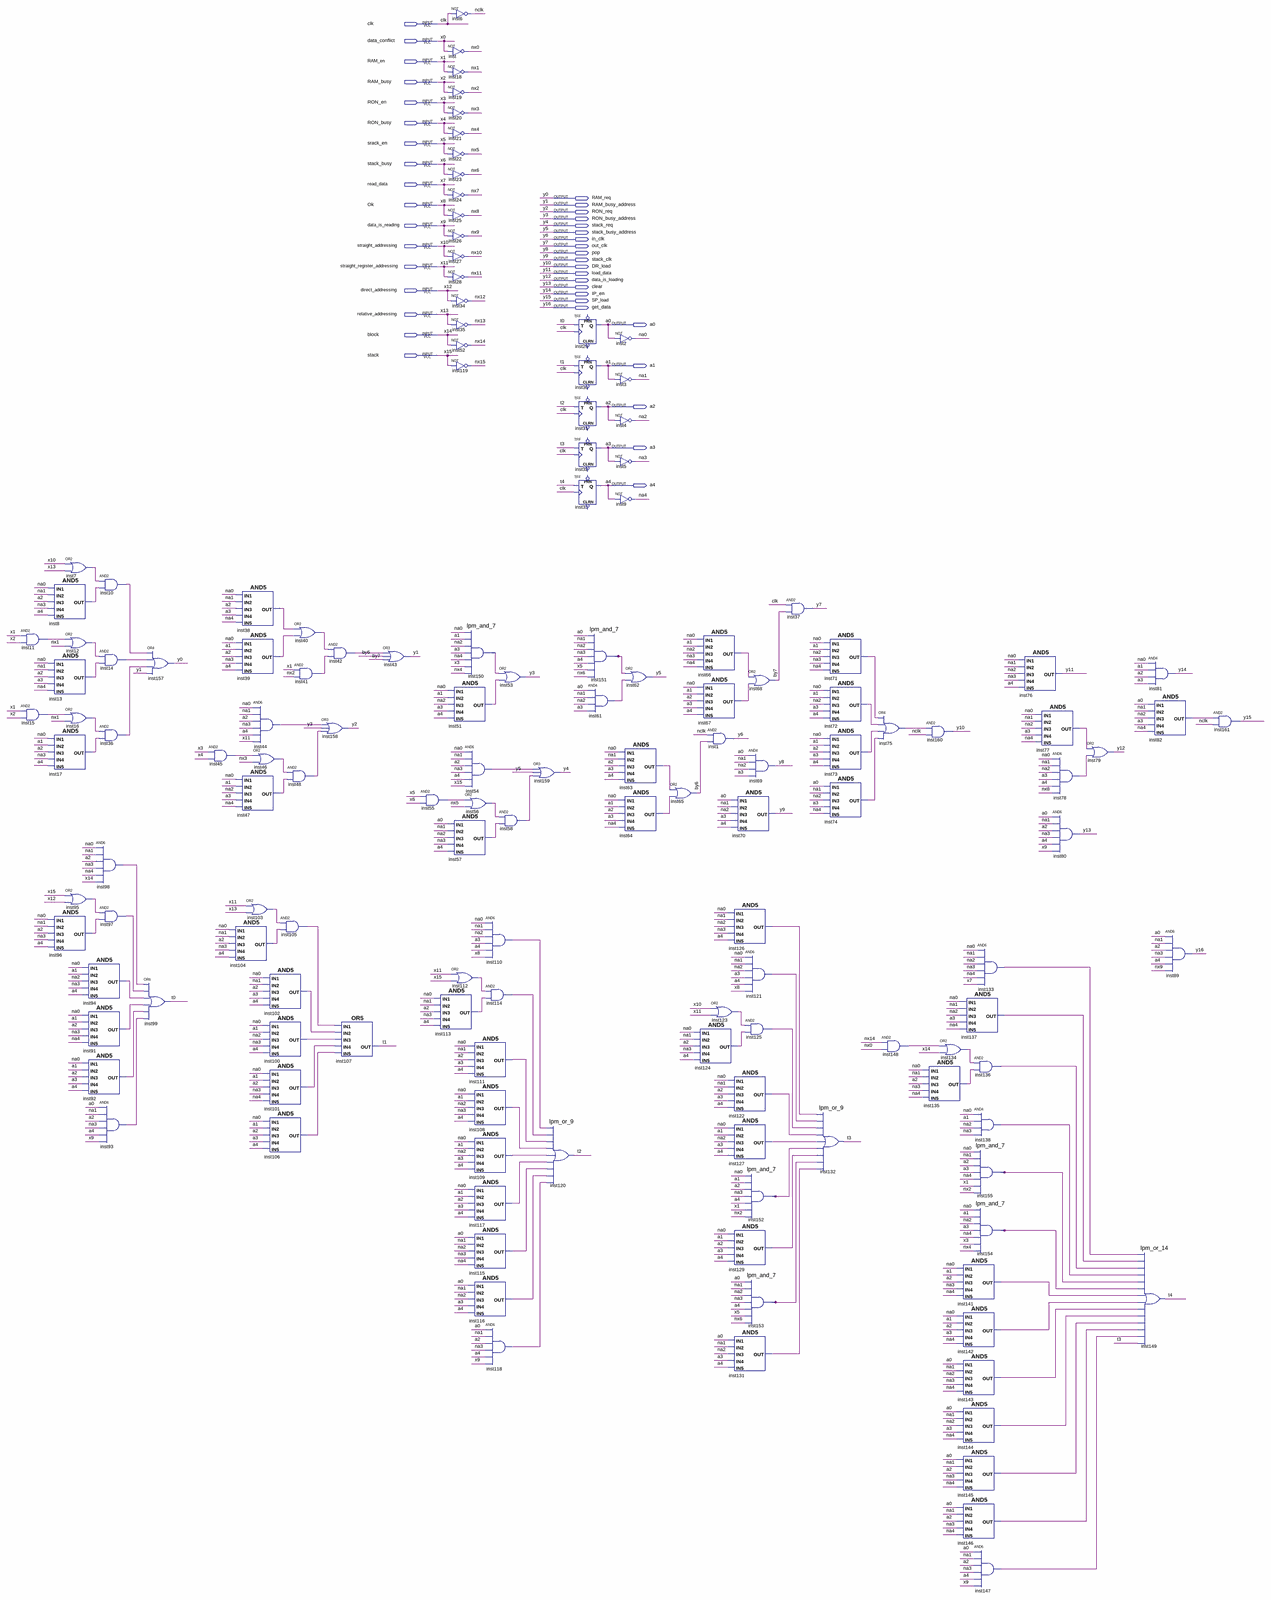
[diagram p0: schematic sheet, whole]
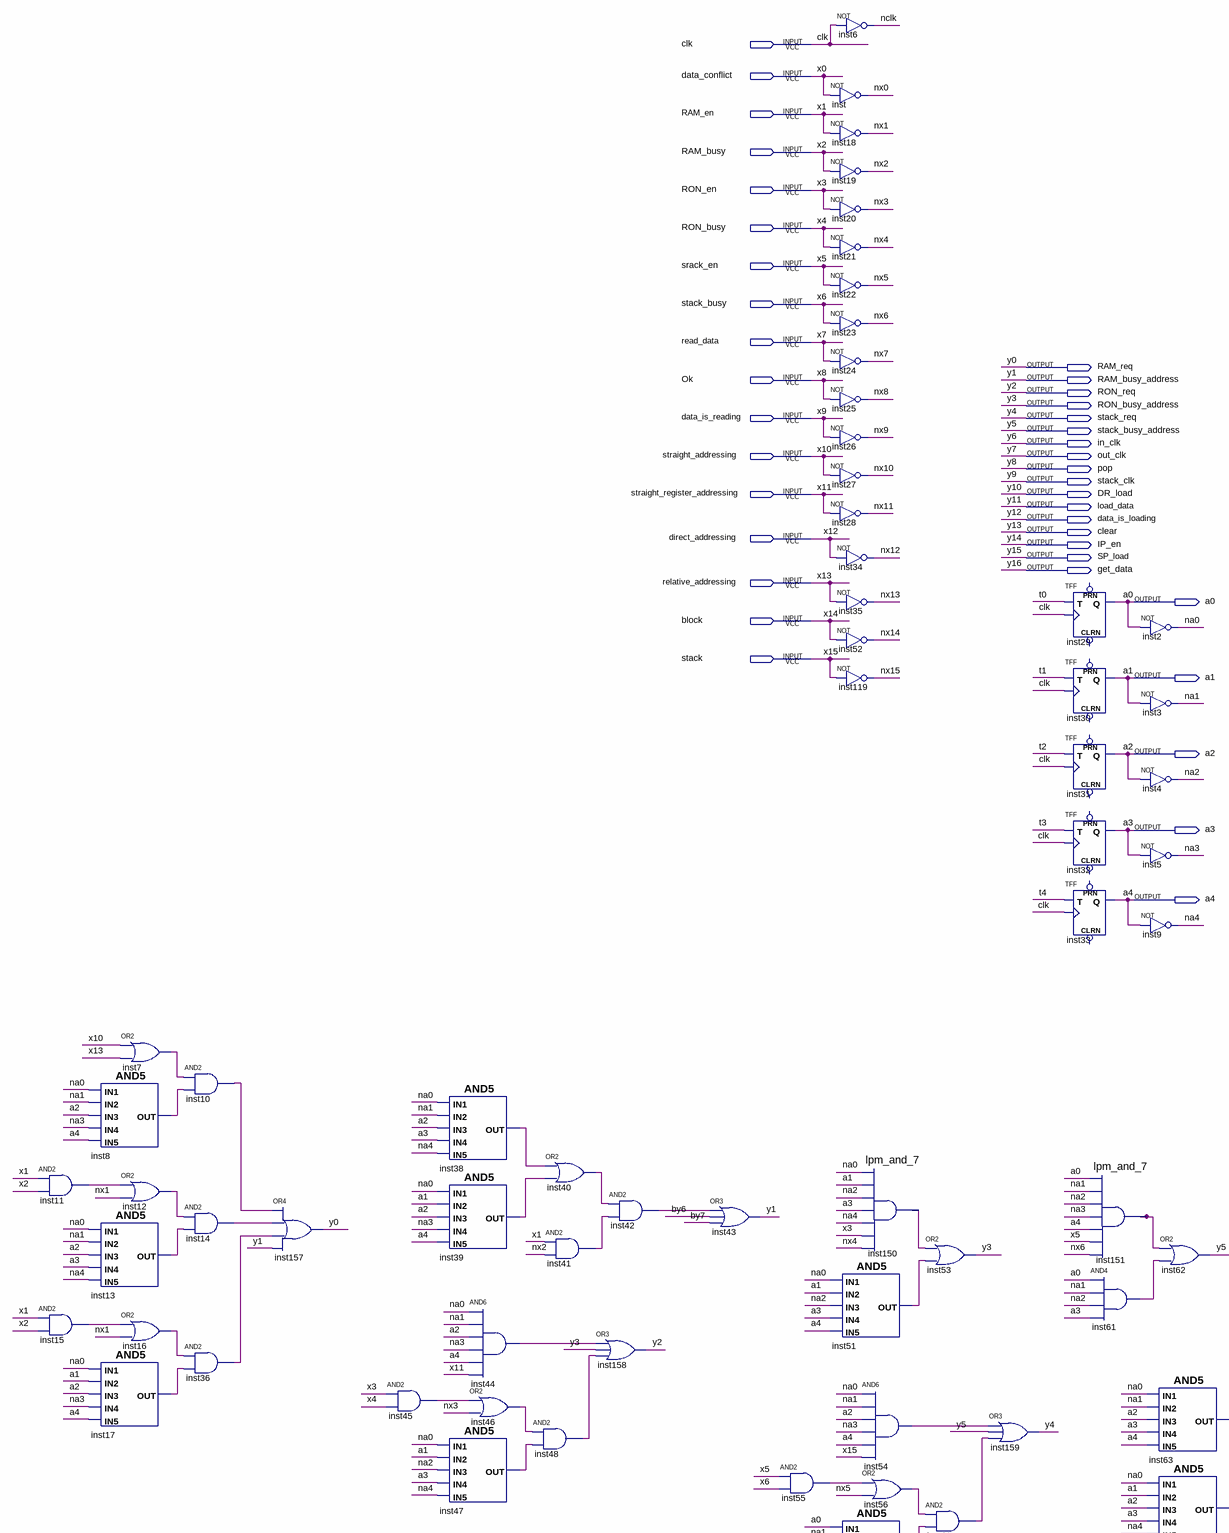
[diagram p1: schematic sheet, upper left part]
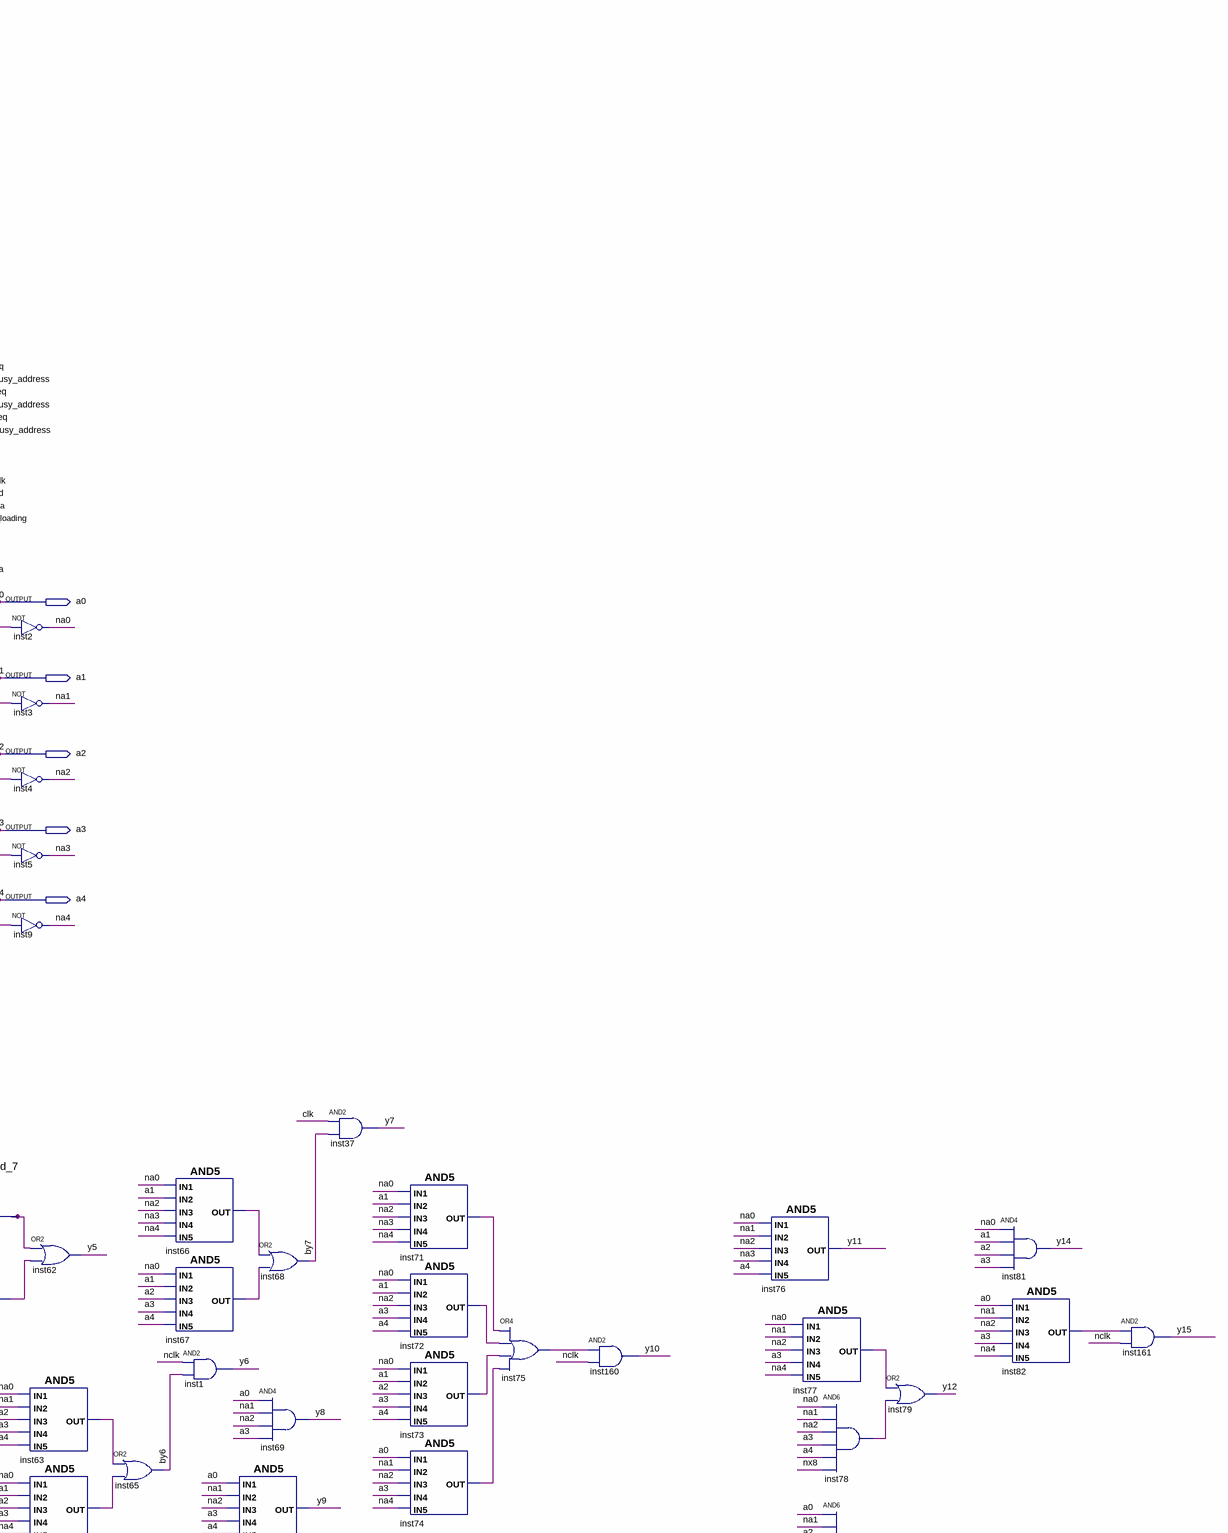
[diagram p2: schematic sheet, upper right part]
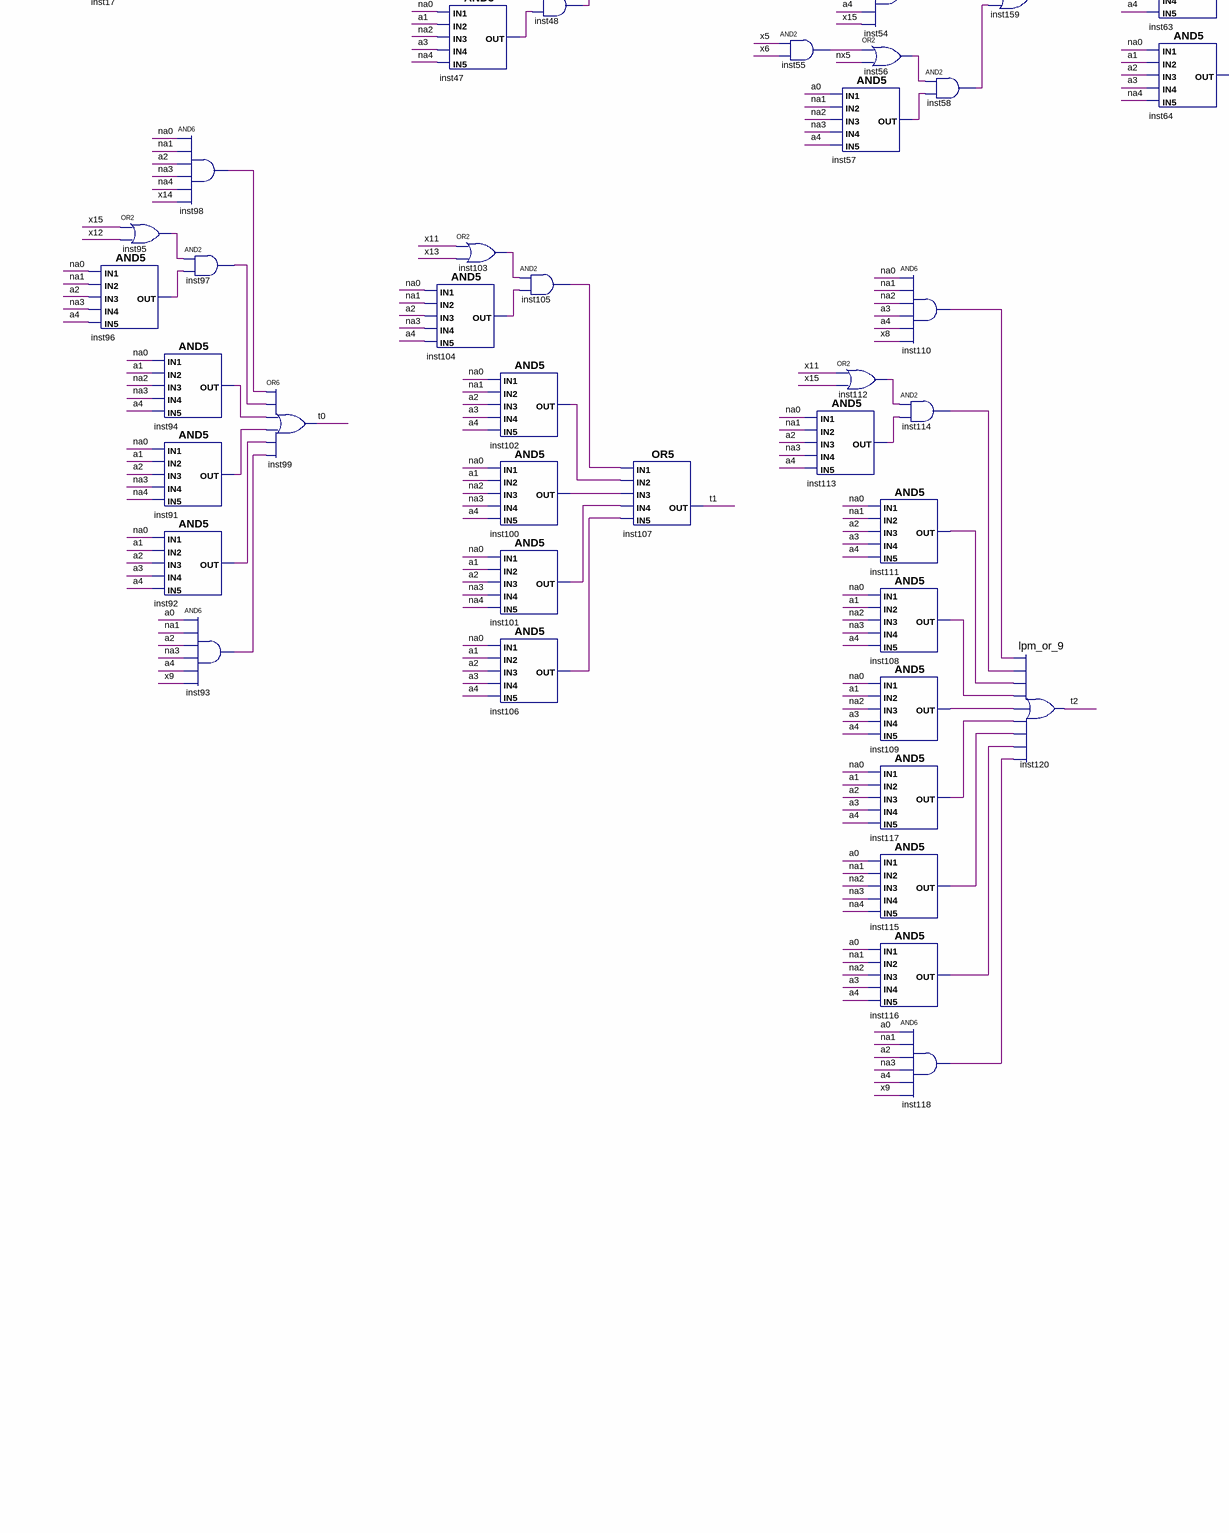
[diagram p3: schematic sheet, lower left part]
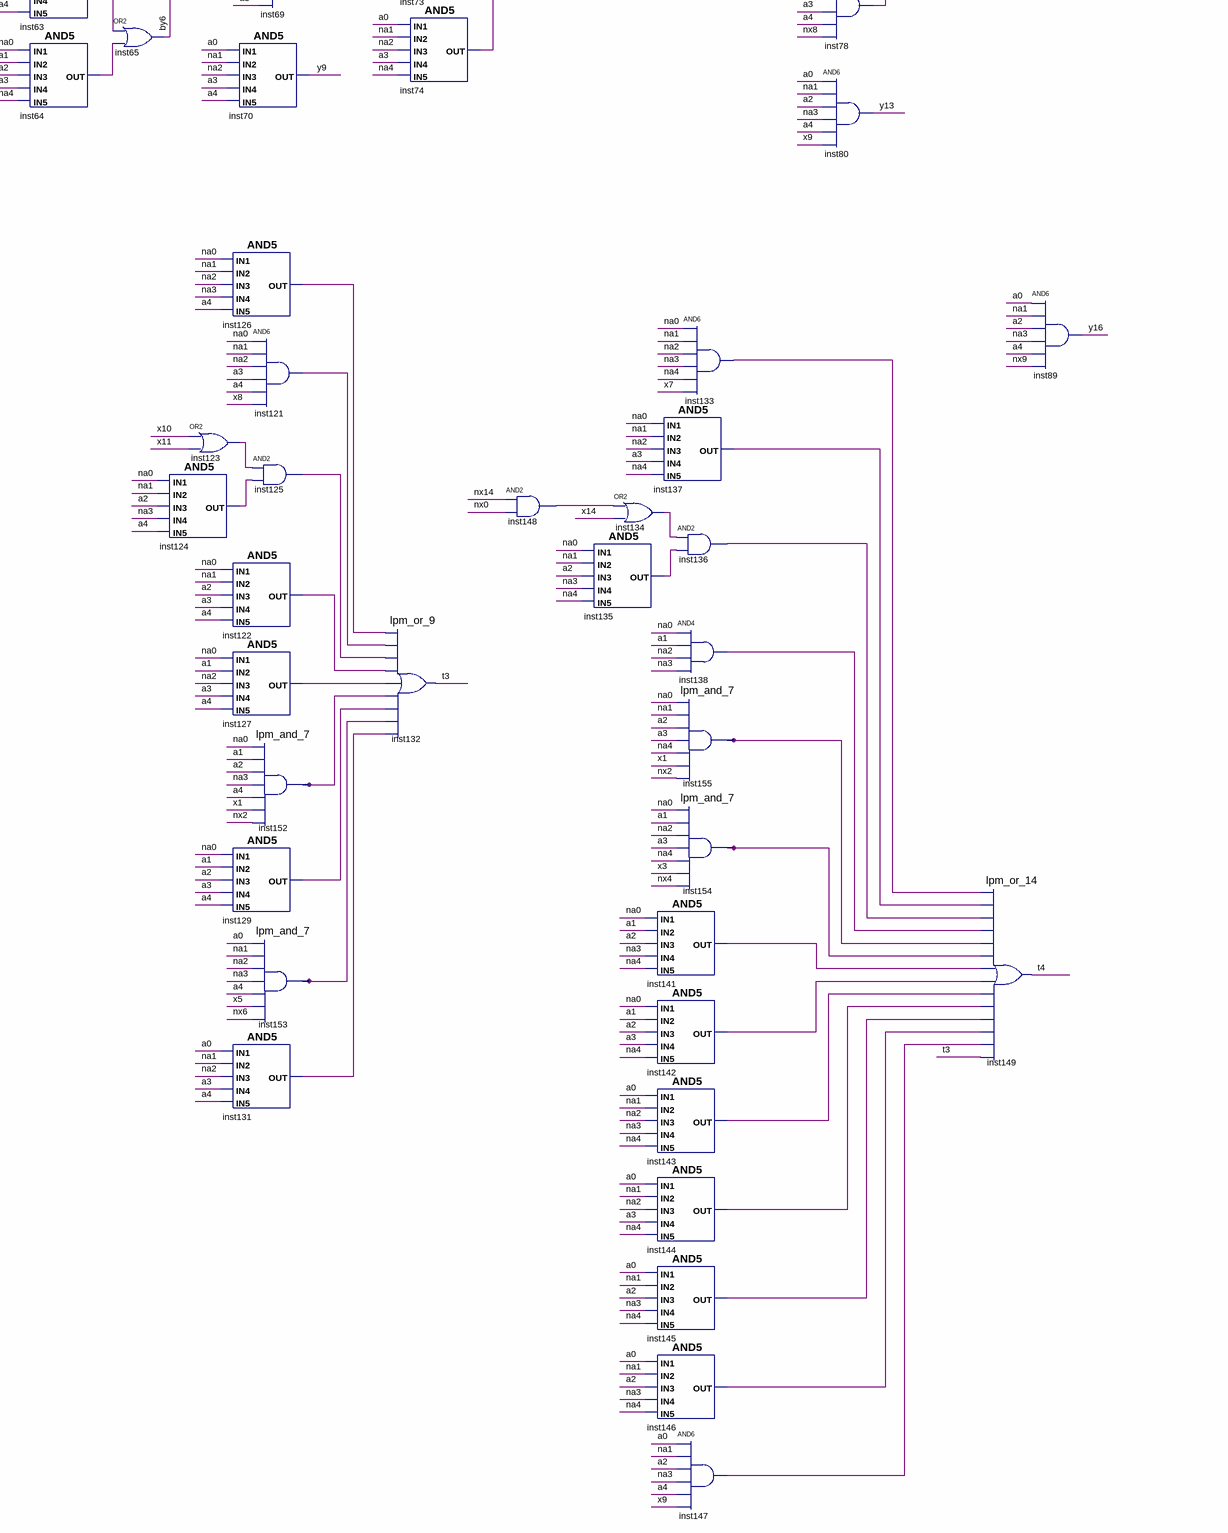
[diagram p4: schematic sheet, lower right part]
// Quartus schematic read_data.bdf as structural Verilog: 146 symbols, 39 pins
module read_data (
  input  clk,
  input  data_conflict,
  input  RAM_en,
  input  RAM_busy,
  input  RON_en,
  input  RON_busy,
  input  srack_en,
  input  stack_busy,
  input  read_data,
  input  Ok,
  input  data_is_reading,
  input  straight_addressing,
  input  straight_register_addressing,
  input  direct_addressing,
  input  relative_addressing,
  input  block,
  input  stack,
  output RAM_req,
  output RAM_busy_address,
  output RON_req,
  output RON_busy_address,
  output stack_req,
  output stack_busy_address,
  output in_clk,
  output out_clk,
  output pop,
  output stack_clk,
  output DR_load,
  output load_data,
  output data_is_loading,
  output clear,
  output IP_en,
  output SP_load,
  output get_data,
  output a0,
  output a1,
  output a2,
  output a3,
  output a4
);

  wire by6, by7, inst7_out, inst8_out, inst10_out, inst11_out, inst12_out, inst13_out, inst14_out,
       inst15_out, inst16_out, inst17_out, inst36_out, inst38_out, inst39_out, inst40_out, inst41_out,
       inst42_out, inst44_out, inst45_out, inst46_out, inst47_out, inst48_out, inst51_out, inst54_out,
       inst55_out, inst56_out, inst57_out, inst58_out, inst61_out, inst63_out, inst64_out, inst66_out,
       inst67_out, inst71_out, inst72_out, inst73_out, inst74_out, inst75_out, inst77_out, inst78_out,
       inst82_out, inst91_out, inst92_out, inst93_out, inst94_out, inst95_out, inst96_out, inst97_out,
       inst98_out, inst100_out, inst101_out, inst102_out, inst103_out, inst104_out, inst105_out, inst106_out,
       inst108_out, inst109_out, inst110_out, inst111_out, inst112_out, inst113_out, inst114_out,
       inst115_out, inst116_out, inst117_out, inst118_out, inst121_out, inst122_out, inst123_out,
       inst124_out, inst125_out, inst126_out, inst127_out, inst129_out, inst131_out, inst133_out,
       inst134_out, inst135_out, inst136_out, inst137_out, inst138_out, inst141_out, inst142_out,
       inst143_out, inst144_out, inst145_out, inst146_out, inst147_out, inst148_out, inst150_result,
       inst151_result, inst152_result, inst153_result, inst154_result, inst155_result, na0, na1, na2, na3,
       na4, nclk, nx0, nx1, nx2, nx3, nx4, nx5, nx6, nx7, nx8, nx9, nx10, nx11, nx12, nx13, nx14, nx15, t0,
       t1, t2, t3, t4;

  and inst11 (inst11_out, RAM_en, RAM_busy);
  and inst15 (inst15_out, RAM_en, RAM_busy);
  or inst7 (inst7_out, straight_addressing, relative_addressing);
  and inst8 (inst8_out, na0, na1, a2, na3, a4);
  or inst12 (inst12_out, inst11_out, nx1);
  and inst13 (inst13_out, na0, na1, a2, a3, na4);
  or inst16 (inst16_out, inst15_out, nx1);
  and inst17 (inst17_out, na0, a1, a2, na3, a4);
  or inst95 (inst95_out, stack, direct_addressing);
  and inst96 (inst96_out, na0, na1, a2, na3, a4);
  and inst10 (inst10_out, inst7_out, inst8_out);
  and inst14 (inst14_out, inst12_out, inst13_out);
  and inst36 (inst36_out, inst16_out, inst17_out);
  and inst98 (inst98_out, na0, na1, a2, na3, na4, block);
  and inst97 (inst97_out, inst95_out, inst96_out);
  and inst94 (inst94_out, na0, a1, na2, na3, a4);
  and inst91 (inst91_out, na0, a1, a2, na3, na4);
  and inst92 (inst92_out, na0, a1, a2, a3, a4);
  and inst93 (inst93_out, a0, na1, a2, na3, a4, data_is_reading);
  or inst157 (RAM_req, inst10_out, inst14_out, inst36_out, RAM_busy_address);
  or inst99 (t0, inst98_out, inst97_out, inst94_out, inst91_out, inst92_out, inst93_out);
  and inst45 (inst45_out, RON_en, RON_busy);
  and inst38 (inst38_out, na0, na1, a2, a3, na4);
  and inst39 (inst39_out, na0, a1, a2, na3, a4);
  and inst47 (inst47_out, na0, a1, na2, a3, na4);
  and inst104 (inst104_out, na0, na1, a2, na3, a4);
  and inst44 (inst44_out, na0, na1, a2, na3, a4, straight_register_addressing);
  or inst46 (inst46_out, inst45_out, nx3);
  or inst103 (inst103_out, straight_register_addressing, relative_addressing);
  and inst102 (inst102_out, na0, na1, a2, a3, a4);
  and inst100 (inst100_out, na0, a1, na2, na3, a4);
  and inst101 (inst101_out, na0, a1, a2, na3, na4);
  and inst106 (inst106_out, na0, a1, a2, a3, a4);
  and inst48 (inst48_out, inst46_out, inst47_out);
  and inst105 (inst105_out, inst103_out, inst104_out);
  or inst40 (inst40_out, inst38_out, inst39_out);
  and inst41 (inst41_out, RAM_en, nx2);
  and inst42 (inst42_out, inst40_out, inst41_out);
  or inst158 (RON_req, inst44_out, RON_busy_address, inst48_out);
  or inst107 (t1, inst105_out, inst102_out, inst100_out, inst101_out, inst106_out);
  or inst43 (RAM_busy_address, inst42_out, by6, by7);
  and inst55 (inst55_out, srack_en, stack_busy);
  not inst6 (nclk, clk);
  not inst (nx0, data_conflict);
  not inst18 (nx1, RAM_en);
  not inst19 (nx2, RAM_busy);
  not inst20 (nx3, RON_en);
  not inst21 (nx4, RON_busy);
  not inst22 (nx5, srack_en);
  not inst23 (nx6, stack_busy);
  not inst24 (nx7, read_data);
  not inst25 (nx8, Ok);
  not inst26 (nx9, data_is_reading);
  not inst27 (nx10, straight_addressing);
  not inst28 (nx11, straight_register_addressing);
  not inst34 (nx12, direct_addressing);
  not inst35 (nx13, relative_addressing);
  not inst52 (nx14, block);
  not inst119 (nx15, stack);
  and inst51 (inst51_out, na0, a1, na2, a3, a4);
  and inst57 (inst57_out, a0, na1, na2, na3, a4);
  or inst112 (inst112_out, straight_register_addressing, stack);
  and inst113 (inst113_out, na0, na1, a2, na3, a4);
  lpm_and_7 inst150 (
    .data0(na0), .data1(a1), .data2(na2), .data3(a3), .data4(na4), .data5(RON_en), .data6(nx4),
    .result(inst150_result));
  and inst54 (inst54_out, na0, na1, a2, na3, a4, stack);
  or inst56 (inst56_out, inst55_out, nx5);
  and inst111 (inst111_out, na0, na1, a2, a3, a4);
  and inst108 (inst108_out, na0, a1, na2, na3, a4);
  and inst109 (inst109_out, na0, a1, na2, a3, a4);
  and inst117 (inst117_out, na0, a1, a2, a3, a4);
  and inst115 (inst115_out, a0, na1, na2, na3, na4);
  and inst116 (inst116_out, a0, na1, na2, a3, a4);
  or inst53 (RON_busy_address, inst150_result, inst51_out);
  and inst58 (inst58_out, inst56_out, inst57_out);
  and inst110 (inst110_out, na0, na1, na2, a3, a4, Ok);
  and inst114 (inst114_out, inst112_out, inst113_out);
  and inst118 (inst118_out, a0, na1, a2, na3, a4, data_is_reading);
  or inst159 (stack_req, inst54_out, stack_busy_address, inst58_out);
  lpm_or_9 inst120 (
    .data0(inst110_out), .data1(inst114_out), .data2(inst111_out), .data3(inst108_out), .data4(inst109_out),
    .data5(inst117_out), .data6(inst115_out), .data7(inst116_out), .data8(inst118_out), .result(t2));
  TFF inst29 (.T(t0), .CLK(clk), .Q(a0));  // open: PRN, CLRN
  TFF inst30 (.T(t1), .CLK(clk), .Q(a1));  // open: PRN, CLRN
  TFF inst31 (.T(t2), .CLK(clk), .Q(a2));  // open: PRN, CLRN
  TFF inst32 (.T(t3), .CLK(clk), .Q(a3));  // open: PRN, CLRN
  TFF inst33 (.T(t4), .CLK(clk), .Q(a4));  // open: PRN, CLRN
  lpm_and_7 inst151 (
    .data0(a0), .data1(na1), .data2(na2), .data3(na3), .data4(a4), .data5(srack_en), .data6(nx6),
    .result(inst151_result));
  and inst61 (inst61_out, a0, na1, na2, a3);
  not inst2 (na0, a0);
  not inst3 (na1, a1);
  not inst4 (na2, a2);
  not inst5 (na3, a3);
  not inst9 (na4, a4);
  and inst63 (inst63_out, na0, na1, a2, a3, a4);
  and inst64 (inst64_out, na0, a1, a2, a3, na4);
  or inst62 (stack_busy_address, inst151_result, inst61_out);
  or inst65 (by6, inst63_out, inst64_out);
  and inst66 (inst66_out, na0, a1, na2, na3, na4);
  and inst67 (inst67_out, na0, a1, a2, a3, a4);
  and inst124 (inst124_out, na0, na1, a2, na3, a4);
  and inst1 (in_clk, nclk, by6);
  and inst126 (inst126_out, na0, na1, na2, na3, a4);
  or inst123 (inst123_out, straight_addressing, straight_register_addressing);
  and inst122 (inst122_out, na0, na1, a2, a3, a4);
  and inst127 (inst127_out, na0, a1, na2, a3, a4);
  and inst129 (inst129_out, na0, a1, a2, a3, a4);
  and inst131 (inst131_out, a0, na1, na2, a3, a4);
  or inst68 (by7, inst66_out, inst67_out);
  and inst69 (pop, a0, na1, na2, a3);
  and inst70 (stack_clk, a0, na1, na2, a3, a4);
  and inst121 (inst121_out, na0, na1, na2, a3, a4, Ok);
  and inst125 (inst125_out, inst123_out, inst124_out);
  lpm_and_7 inst152 (
    .data0(na0), .data1(a1), .data2(a2), .data3(na3), .data4(a4), .data5(RAM_en), .data6(nx2),
    .result(inst152_result));
  lpm_and_7 inst153 (
    .data0(a0), .data1(na1), .data2(na2), .data3(na3), .data4(a4), .data5(srack_en), .data6(nx6),
    .result(inst153_result));
  and inst37 (out_clk, clk, by7);
  and inst71 (inst71_out, na0, a1, na2, na3, na4);
  and inst72 (inst72_out, na0, a1, na2, a3, a4);
  and inst73 (inst73_out, na0, a1, a2, a3, a4);
  and inst74 (inst74_out, a0, na1, na2, a3, na4);
  lpm_or_9 inst132 (
    .data0(inst126_out), .data1(inst121_out), .data2(inst125_out), .data3(inst122_out), .data4(inst127_out),
    .data5(inst152_result), .data6(inst129_out), .data7(inst153_result), .data8(inst131_out), .result(t3));
  or inst75 (inst75_out, inst71_out, inst72_out, inst73_out, inst74_out);
  and inst148 (inst148_out, nx14, nx0);
  and inst160 (DR_load, inst75_out, nclk);
  or inst134 (inst134_out, inst148_out, block);
  and inst135 (inst135_out, na0, na1, a2, na3, na4);
  and inst137 (inst137_out, na0, na1, na2, a3, na4);
  and inst136 (inst136_out, inst134_out, inst135_out);
  and inst138 (inst138_out, na0, a1, na2, na3);
  lpm_and_7 inst155 (
    .data0(na0), .data1(na1), .data2(a2), .data3(a3), .data4(na4), .data5(RAM_en), .data6(nx2),
    .result(inst155_result));
  lpm_and_7 inst154 (
    .data0(na0), .data1(a1), .data2(na2), .data3(a3), .data4(na4), .data5(RON_en), .data6(nx4),
    .result(inst154_result));
  and inst141 (inst141_out, na0, a1, a2, na3, na4);
  and inst142 (inst142_out, na0, a1, a2, a3, na4);
  and inst143 (inst143_out, a0, na1, na2, na3, na4);
  and inst144 (inst144_out, a0, na1, na2, a3, na4);
  and inst145 (inst145_out, a0, na1, a2, na3, na4);
  and inst146 (inst146_out, a0, na1, a2, na3, na4);
  and inst147 (inst147_out, a0, na1, a2, na3, a4, data_is_reading);
  and inst133 (inst133_out, na0, na1, na2, na3, na4, read_data);
  and inst76 (load_data, na0, na1, na2, na3, a4);
  and inst77 (inst77_out, na0, na1, na2, a3, na4);
  and inst78 (inst78_out, na0, na1, na2, a3, a4, nx8);
  and inst80 (clear, a0, na1, a2, na3, a4, data_is_reading);
  or inst79 (data_is_loading, inst77_out, inst78_out);
  lpm_or_14 inst149 (
    .data0(inst133_out), .data1(inst137_out), .data2(inst136_out), .data3(inst138_out),
    .data4(inst155_result), .data5(inst154_result), .data6(inst141_out), .data7(inst142_out),
    .data8(inst143_out), .data9(inst144_out), .data10(inst145_out), .data11(inst146_out),
    .data12(inst147_out), .data13(t3), .result(t4));
  and inst81 (IP_en, na0, a1, a2, a3);
  and inst82 (inst82_out, a0, na1, na2, a3, na4);
  and inst89 (get_data, a0, na1, a2, na3, a4, nx9);
  and inst161 (SP_load, inst82_out, nclk);

  // Other names for the same wires on the sheet: x14 = block; x12 = direct_addressing; x15 = stack;
  //   x10 = straight_addressing; x11 = straight_register_addressing; x0 = data_conflict; x1 = RAM_en; x2 = RAM_busy;
  //   x3 = RON_en; x4 = RON_busy; x5 = srack_en; x6 = stack_busy; x7 = read_data; x8 = Ok; x9 = data_is_reading;
  //   x13 = relative_addressing; y0 = RAM_req; y1 = RAM_busy_address; y2 = RON_req; y3 = RON_busy_address;
  //   y4 = stack_req; y5 = stack_busy_address; y6 = in_clk; y7 = out_clk; y8 = pop; y9 = stack_clk; y10 = DR_load;
  //   y11 = load_data; y12 = data_is_loading; y13 = clear; y14 = IP_en; y15 = SP_load; y16 = get_data
endmodule
